# EAGLE design CT Sensor with Photon (EAGLE 9.5.1)
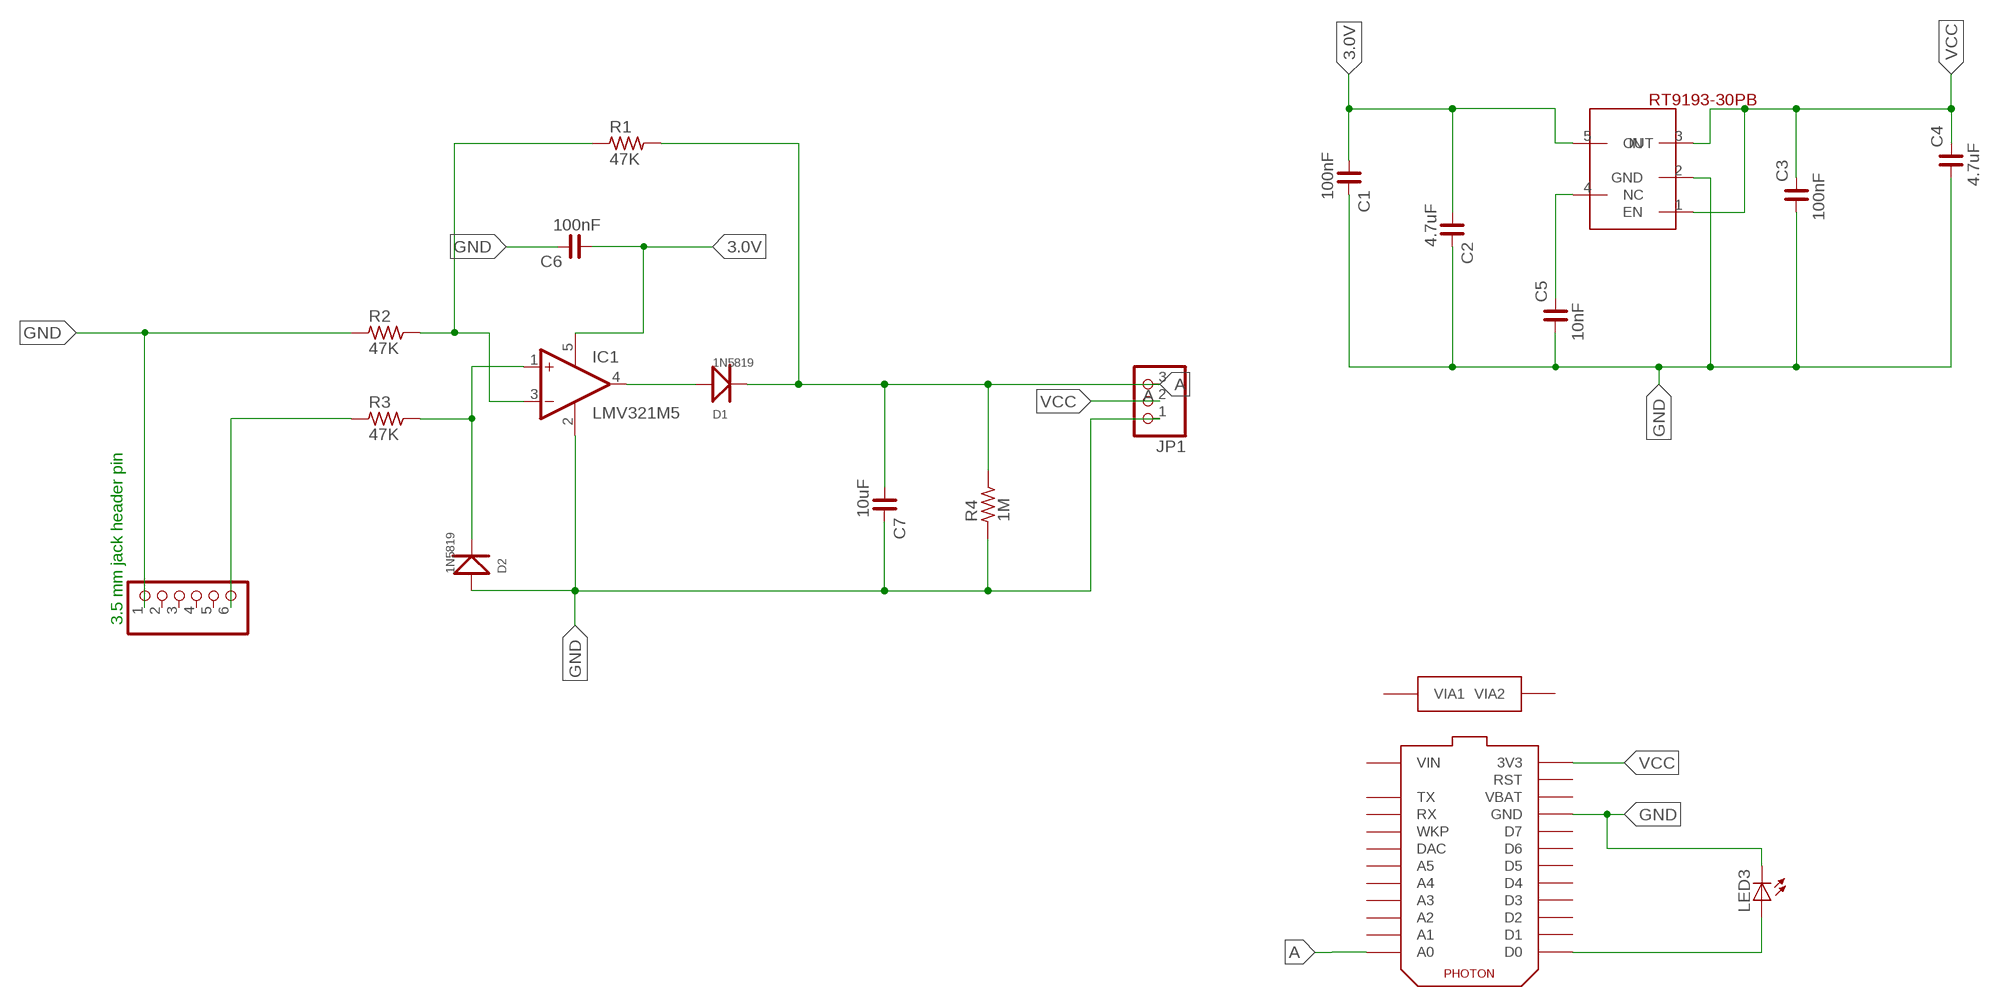
[diagram p0: schematic, sheet 1]

## Parts
C1  100nF  C_0201  [C0201]
C2  4.7uF  C_0201  [C0201]
C3  100nF  C_0201  [C0201]
C4  4.7uF  C_0201  [C0201]
C5  10nF  C_0201  [C0201]
C6  100nF  C_0201  [C0201]
C7  10uF  C_0201  [C0201]
D1  1N5819  [SOD-123]
D2  1N5819  [SOD-123]
IC1  LMV321M5  [SOT23-5]
JP1  PINHD-1X3  [1X03]
JP2  PINHD-1X6  [1X06]
LED3  LED  [SMARTLED-TTW]
R1  47K  R_0201  [R0201]
R2  47K  R_0201  [R0201]
R3  47K  R_0201  [R0201]
R4  1M  R_0201  [R0201]
U$1  RT9193-30PB  [SOP65P212X110-6N]
U$2  TEMPLATE_PHOTON_RAW  [PHOTON_RAW]

## Nets
3.0V: C1.1 C2.1 C6.1 IC1.5(V+) U$1.5(OUT)
A: C7.1 D1.K JP1.3 R1.2 R4.2 U$2.A0 U$2.A0.(A0) U$2.A0@1(A0)
GND: C1.2 C2.2 C3.1 C4.1 C5.1 C6.2 C7.2 D2.A IC1.2(V-) JP1.1 JP2.1 LED3.C@1(C) R2.1 R4.1 U$1.2(GND) U$2.GND U$2.GND1(GND) U$2.GND.(GND) U$2.GND.@1(GND) U$2.GND@1(GND) U$2.GND@2(GND)
N$1: D2.K IC1.1(+IN) R3.2
N$2: C5.2 U$1.4(NC)
N$3: IC1.3(-IN) R1.1 R2.2
N$4: D1.A IC1.4(OUT)
N$5: LED3.A@1(A) U$2.D0 U$2.D0.(D0) U$2.D0@1(D0)
N$6: JP2.6 R3.1
VCC: C3.2 C4.2 JP1.2 U$1.1(EN) U$1.3(IN) U$2.3V3 U$2.3V3.(3V3) U$2.3V31(3V3)
Unconnected: JP2.2 JP2.3 JP2.4 JP2.5 U$2.A1 U$2.A1.(A1) U$2.A1@1(A1) U$2.A2 U$2.A2.(A2) U$2.A2@1(A2) U$2.A3 U$2.A3.(A3) U$2.A3@1(A3) U$2.A4 U$2.A4.(A4) U$2.A4@1(A4) U$2.A5 U$2.A5.(A5) U$2.A5@1(A5) U$2.D1 U$2.D1.(D1) U$2.D1@1(D1) U$2.D2 U$2.D2.(D2) U$2.D2@1(D2) U$2.D3 U$2.D3.(D3) U$2.D3@1(D3) U$2.D4 U$2.D4.(D4) U$2.D4@1(D4) U$2.D5 U$2.D5.(D5) U$2.D5@1(D5) U$2.D6 U$2.D6.(D6) U$2.D6@1(D6) U$2.D7 U$2.D7.(D7) U$2.D7@1(D7) U$2.DAC U$2.DAC1(DAC) U$2.DAC.(DAC) U$2.P$1(VIA1) U$2.P$2(VIA2) U$2.RST U$2.RST1(RST) U$2.RST.(RST) U$2.RX U$2.RX1(RX) U$2.RX.(RX) U$2.TX U$2.TX1(TX) U$2.TX.(TX) U$2.VBAT U$2.VBAT1(VBAT) U$2.VBAT.(VBAT) U$2.VIN U$2.VIN1(VIN) U$2.VIN.(VIN) U$2.WKP U$2.WKP1(WKP) U$2.WKP.(WKP)

## Notes on the sheet
- 3.5 mm jack header pin

## Library data of the parts
C1-C7 = rc-master-smd:C_: NON-POLARIZED CAP
D1 D2 = 1N5819:1N5819: Buy Part <https://snapeda.com/parts/1N5819/STMicroelectronics/view-part/?ref=eda>; ARROW_ELECTRONICS-PURCHASE-URL: https://snapeda.com/shop?store=Arrow+Electronics&id=2598553; AVAILABILITY: Good; DESCRIPTION: Diode Schottky 40V 1A Through Hole DO-41; DIGIKEY-PURCHASE-URL: https://snapeda.com/shop?store=DigiKey&id=2598553; MF: STMicroelectronics; MOUSER-PURCHASE-URL: https://snapeda.com/shop?store=Mouser&id=2598553; MP: 1N5819; PACKAGE: DO-41 STMicroelectronics; PRICE: None
IC1 = LMV321__:LMV321?*: General Purpose, Low Voltage, Rail-to-Rail Output Operational Amplifiers Source: http://www.national.com/mpf/LM/LMV321.html http://www.national.com/dt/lmv_qual.pdf; AVAILABILITY: Unavailable; DESCRIPTION: General Purpose Amplifier 1 Circuit Rail-to-Rail SOT-23-5; MF: STMicroelectronics; MP: LMV321; PACKAGE: SOT-23-5 STMicroelectronics; PRICE: None
JP1 = adafruit:PINHD-1X3: PIN HEADER
JP2 = adafruit:PINHD-1X6: PIN HEADER
LED3 = adafruit:LED: LED OSRAM: - CHIPLED LG R971, LG N971, LY N971, LG Q971, LY Q971, LO R971, LY R971 LH N974, LH R974 LS Q976, LO Q976, LY Q976 LO Q996 - Hyper CHIPLED LW Q18S LB Q993, LB Q99A, LB R99A - SideLED LS A670, LO A670, LY A670, LG A670, LP A670 LB A673, LV A673, LT A673, LW A673 LH A674 LY A675 LS A676, LA A676, LO A676, LY A676, LW A676 LS A679, LY A679, LG A679 - Hyper Micro SIDELED® LS Y876, LA Y876, LO Y876, LY Y876 LT Y87S - SmartLED LW L88C, LW L88S LB L89C, LB L89S, LG L890 LS L89K, LO L89K, LY L89K LS L896, LA L896, LO L896, LY L896 - TOPLED LS T670, LO T670, LY T670, LG T670, LP T670 LSG T670, LSP T670, LSY T670, LOP T670, LYG T670 LG T671, LOG T671, LSG T671 LB T673, LV T673, LT T673, LW T673 LH T674 LS T676, LA T676, LO T676, LY T676, LB T676, LH T676, LSB T676, LW T676 LB T67C, LV T67C, LT T67C, LS T67K, LO T67K, LY T67K, LW E67C LS E67B, LA E67B, LO E67B, LY E67B, LB E67C, LV E67C, LT E67C LW T67C LS T679, LY T679, LG T679 LS T770, LO T770, LY T770, LG T770, LP T770 LB T773, LV T773, LT T773, LW T773 LH T774 LS E675, LA E675, LY E675, LS T675 LS T776, LA T776, LO T776, LY T776, LB T776 LHGB T686 LT T68C, LB T68C - Hyper Mini TOPLED® LB M676 - Mini TOPLED Santana® LG M470 LS M47K, LO M47K, LY M47K Source: http://www.osram.convergy.de/
R1-R4 = rc-master-smd:R_: RESISTOR
U$1 = RT9193-30PB:RT9193-30PB
U$2 = voltera_community_lib:TEMPLATE_PHOTON

## Board
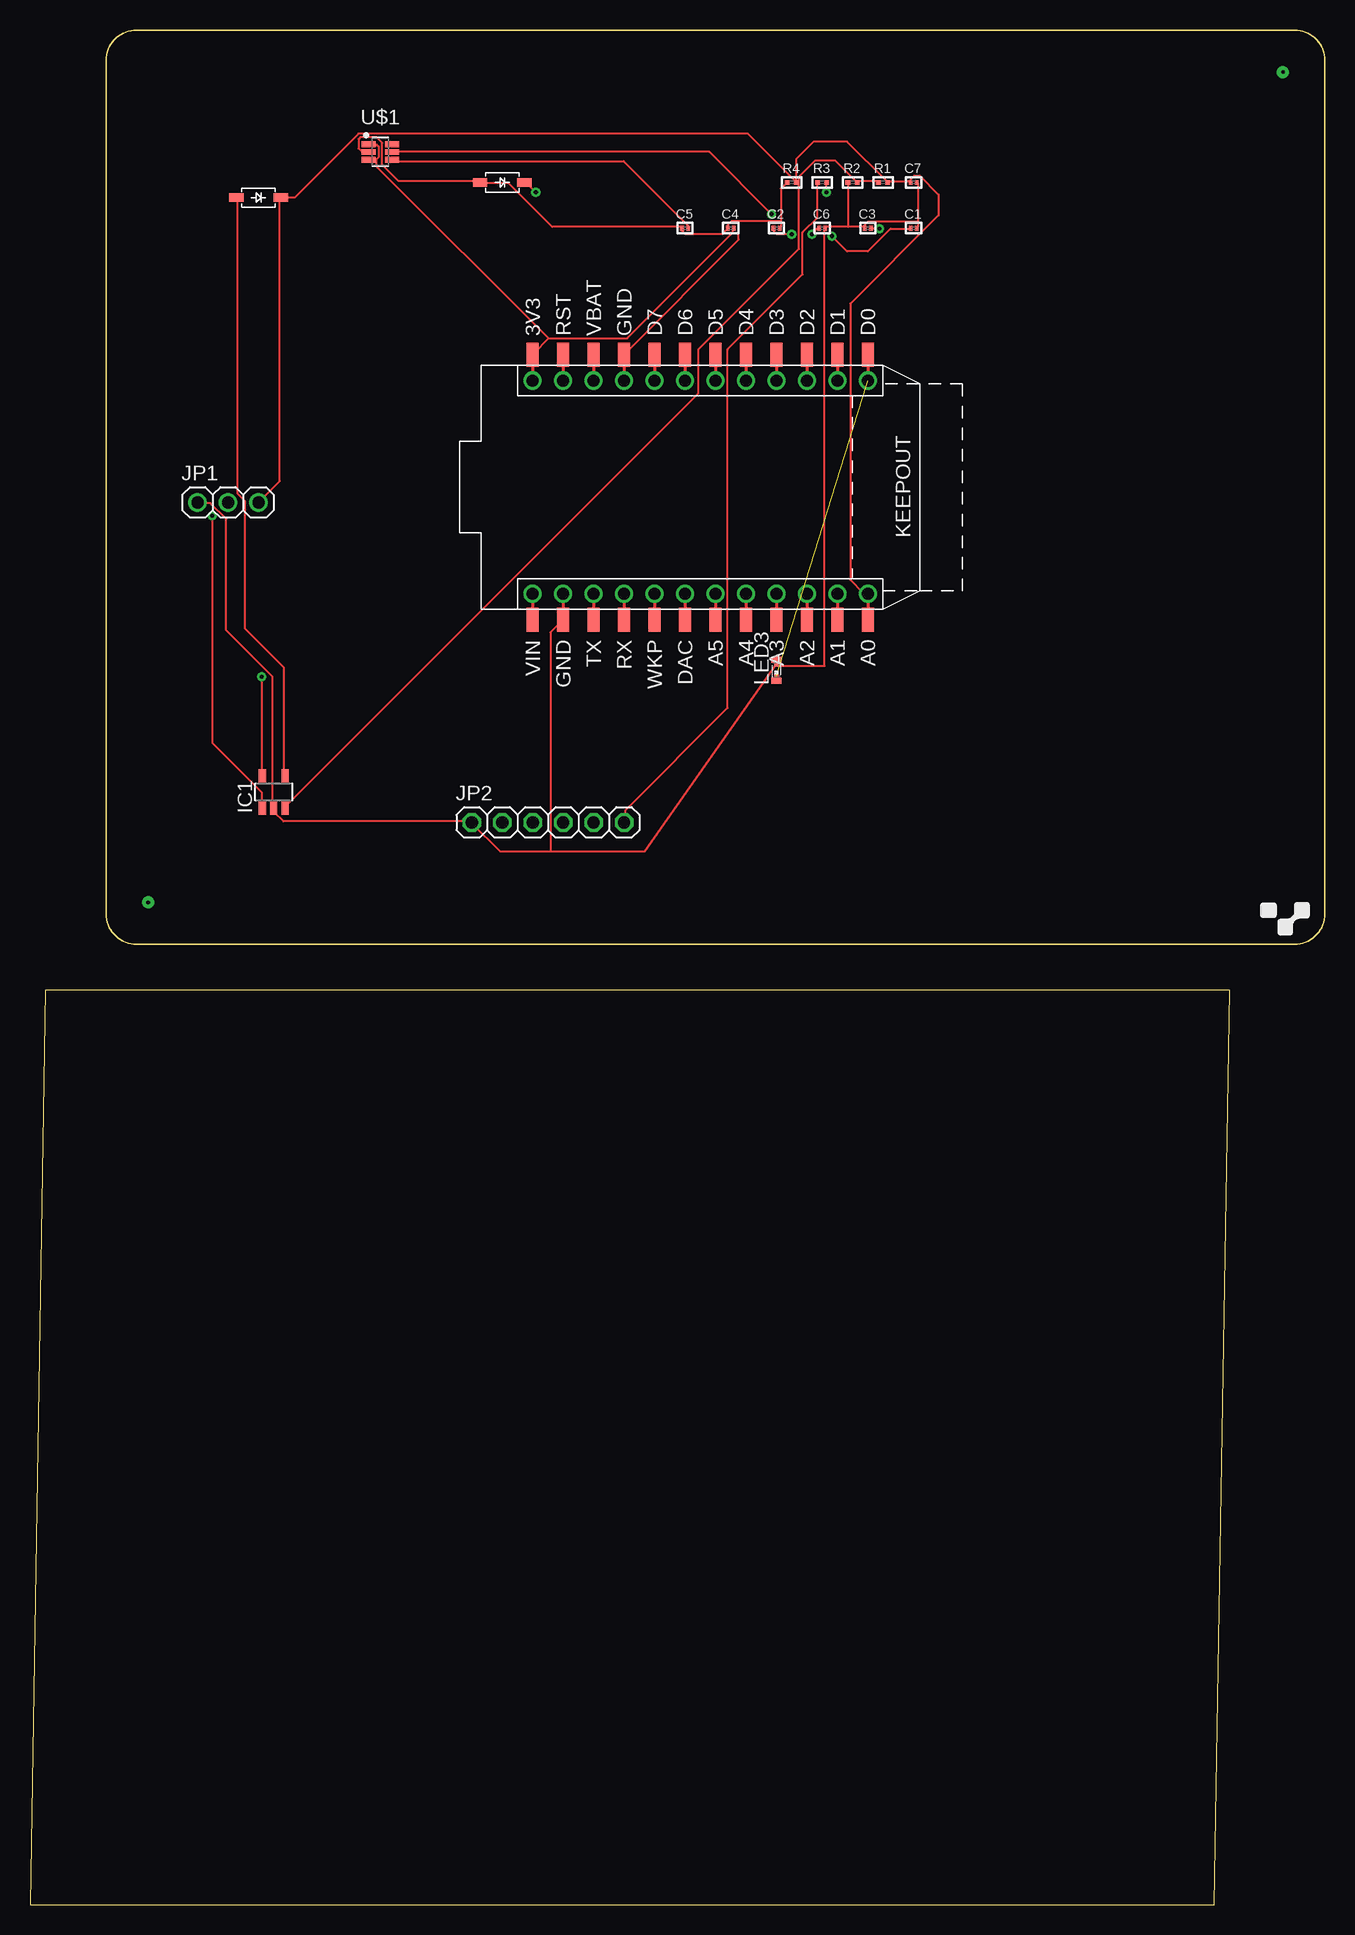
[diagram p1: board, top side]
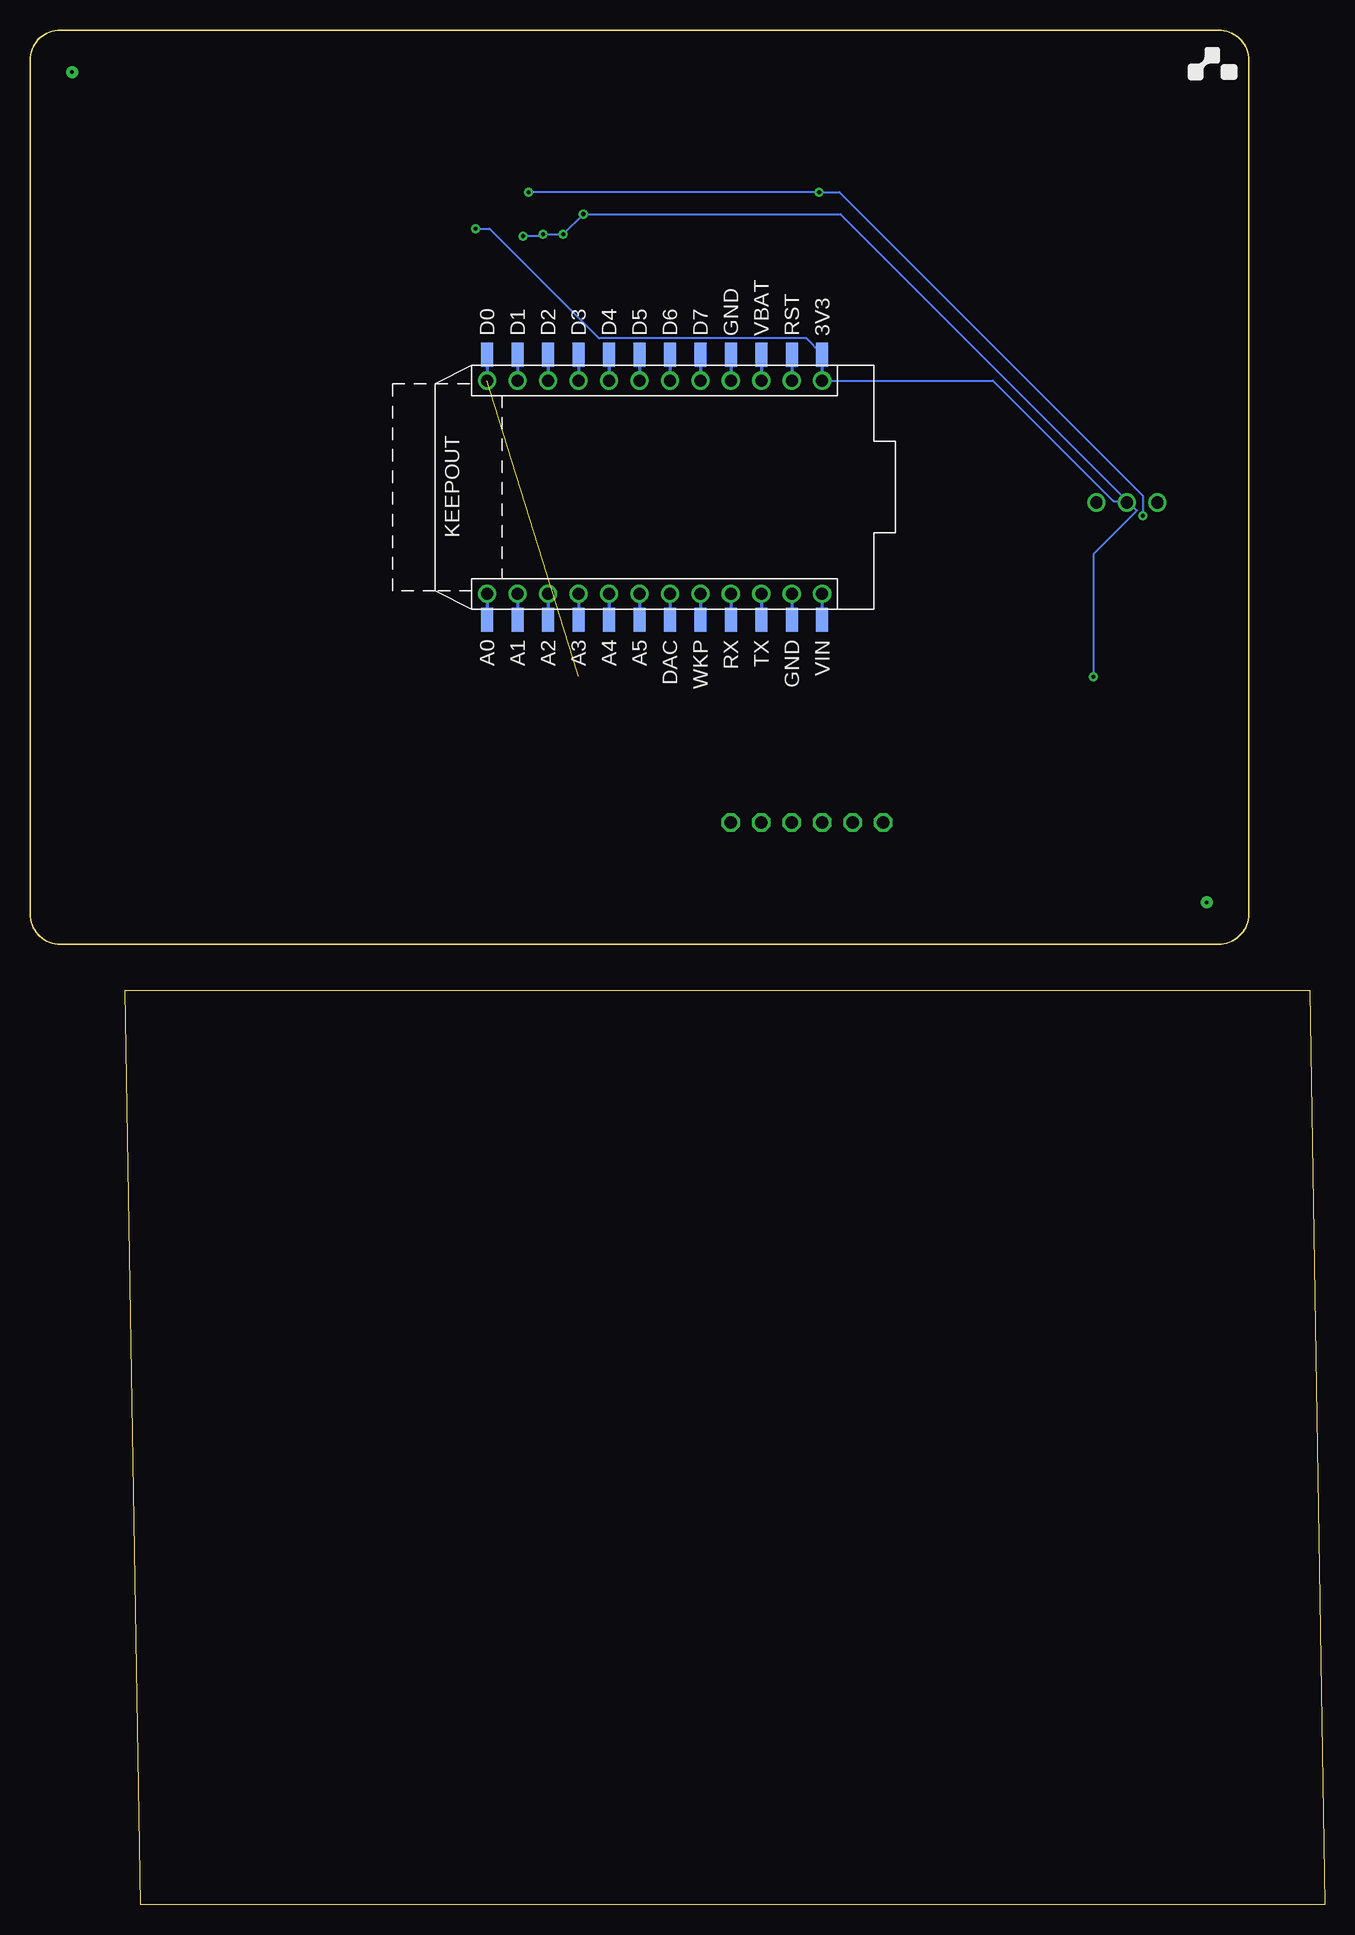
[diagram p2: board, bottom side, seen from below]

Size 107.95 x 156.21 mm. Coordinates in mm from the lower left corner, seen from the top.
Outline: 0,0 98.73,0 100,76.19 1.27,76.19 0,0
Copper layers (1*16): Top 0.035mm / dielectric 1.5mm / Bottom 0.035mm
Design rules "default": minimum track width 6mil, minimum drill 0.35mm, track to track 6mil, track to pad 6mil, pad to pad 6mil, via to via 6mil, smd to smd 6mil, copper to edge 40mil, drill to drill 6mil, minimum pad ring 10mil, minimum via ring 8mil, stop-mask expansion 4mil, vias tented up to drill 0mil, thermal gap 10mil

### Footprints (pad centres in the part's own frame; a part is rotated, then mirrored left to right if it is on the bottom)
C0201 = smd 0.3 x 0.4: 1 -0.254,0; 2 0.254,0
SOD-123 = smd 1.2 x 0.7: A -1.85,0; K 1.85,0
SOT23-5 = smd 0.6 x 1.2: 1 -0.95,-1.306; 2 0,-1.306; 3 0.95,-1.306; 4 0.95,1.306; 5 -0.95,1.306
1X03 = drill 1.016: 1 -2.54,0; 2 0,0; 3 2.54,0
1X06 = drill 1.016 octagon: 1 -6.35,0; 2 -3.81,0; 3 -1.27,0; 4 1.27,0; 5 3.81,0; 6 6.35,0
SMARTLED-TTW = smd 0.8 x 0.5: A 0,-0.875; C 0,0.875 | smd 0.35 x 0.35: A@1 0,-0.5; C@1 0,0.5
R0201 = smd 0.4 x 0.4: 1 -0.381,0; 2 0.381,0
SOP65P212X110-6N = smd 1.192 x 0.484: 1 -0.984,0.65; 2 -0.984,0; 3 -0.984,-0.65; 4 0.984,-0.65; 5 0.984,0; 6 0.984,0.65
PHOTON_RAW = smd 1 x 2 bottom: 3V3 35.56,49.13; A0 63.5,27.07; A1 60.96,27.07; A2 58.42,27.07; A3 55.88,27.07; A4 53.34,27.07; A5 50.8,27.07; D0 63.5,49.13; D1 60.96,49.13; D2 58.42,49.13; D3 55.88,49.13; D4 53.34,49.13; D5 50.8,49.13; D6 48.26,49.13; D7 45.72,49.13; DAC 48.26,27.07; GND 38.1,27.07; GND@1 43.18,49.13; RST 38.1,49.13; RX 43.18,27.07; TX 40.64,27.07; VBAT 40.64,49.13; VIN 35.56,27.07; WKP 45.72,27.07 | drill 1: 3V3. 35.56,46.99; A0. 63.5,29.21; A1. 60.96,29.21; A2. 58.42,29.21; A3. 55.88,29.21; A4. 53.34,29.21; A5. 50.8,29.21; D0. 63.5,46.99; D1. 60.96,46.99; D2. 58.42,46.99; D3. 55.88,46.99; D4. 53.34,46.99; D5. 50.8,46.99; D6. 48.26,46.99; D7. 45.72,46.99; DAC. 48.26,29.21; GND. 38.1,29.21; GND.@1 43.18,46.99; RST. 38.1,46.99; RX. 43.18,29.21; TX. 40.64,29.21; VBAT. 40.64,46.99; VIN. 35.56,29.21; WKP. 45.72,29.21 | smd 1 x 2: 3V31 35.56,49.13; A0@1 63.5,27.07; A1@1 60.96,27.07; A2@1 58.42,27.07; A3@1 55.88,27.07; A4@1 53.34,27.07; A5@1 50.8,27.07; D0@1 63.5,49.13; D1@1 60.96,49.13; D2@1 58.42,49.13; D3@1 55.88,49.13; D4@1 53.34,49.13; D5@1 50.8,49.13; D6@1 48.26,49.13; D7@1 45.72,49.13; DAC1 48.26,27.07; GND1 38.1,27.07; GND@2 43.18,49.13; RST1 38.1,49.13; RX1 43.18,27.07; TX1 40.64,27.07; VBAT1 40.64,49.13; VIN1 35.56,27.07; WKP1 45.72,27.07 | drill 0.3 pad 1: P$1 3.5,3.5; P$2 98.1,72.7

### Placement (x,y rotation side)
C1  73.66,139.7 0 top
C2  62.23,139.7 0 top
C3  69.85,139.7 0 top
C4  58.42,139.7 0 top
C5  54.61,139.7 0 top
C6  66.04,139.7 0 top
C7  73.66,143.51 0 top
D1  19.05,142.24 0 top
D2  39.37,143.51 0 top
IC1  20.32,92.71 0 top
JP1  16.51,116.84 0 top
JP2  43.18,90.17 0 top
LED3  62.23,102.87 0 top
R1  71.12,143.51 0 top
R2  68.58,143.51 0 top
R3  66.04,143.51 0 top
R4  63.5,143.51 0 top
U$1  29.21,146.05 0 top
U$2  6.35,80.01 0 top

### Tracks (layer width: path | path; a pad name or v marks a point on that pad's centre or on a via)
3.0V  (via drill 0.35)
  Top 0.152: C2.1 61.98,139.5 62.28,139.19 v63.5,139.19 | v65.18,139.19 65.79,139.8 C6.1 | v66.85,139.04 68.12,137.77 69.85,137.77 71.73,139.65 73.41,139.65 C1.1 | U$1.5 56.64,146.05 v61.82,140.87 | IC1.5 19.3,94.08 v19.3,102.31 19.55,102.55
  Bottom 0.152: v66.85,139.04 65.33,139.04 v65.18,139.19 v63.5,139.19 v61.82,140.87 40.39,140.87 15.67,116.15 19.3,112.52 v19.3,102.31
A
  Top 0.152: JP1.3 20.83,118.62 20.83,142.24 D1.K 22.05,142.24 27.38,147.57 59.84,147.57 63.8,143.61 R4.2 63.88,145.47 65.33,146.91 68.12,146.91 71.42,143.61 R1.2 71.58,143.61 73.25,143.61 | 73.25,143.61 73.41,143.61 C7.1 | 73.25,143.61 73.71,144.07 74.17,144.07 75.74,142.49 75.74,140.77 68.38,133.4 68.38,110.39 69.44,109.32 69.75,109.32 U$2.A0.
GND
  Top 0.152: U$1.2 27.69,146.05 27.38,146.36 27.38,147.12 27.53,147.27 28.91,147.27 29.36,146.81 29.36,144.98 30.73,143.61 37.44,143.61 D2.A 37.59,143.46 39.88,143.46 43.54,139.8 54.36,139.8 C5.1 54.36,139.5 54.66,139.19 57.71,139.19 58.17,139.65 C4.1 58.17,139.95 58.47,140.26 59.08,140.26 | 62.59,140.26 62.59,143 63.04,143.46 R4.1 | 62.59,140.26 62.59,139.8 C2.2 | 62.59,140.26 59.08,140.26 | 59.08,140.26 59.08,138.74 49.63,129.29 U$2.GND@1 | 74.02,140.26 74.02,143.46 C7.2 | 74.02,140.26 74.02,139.8 C1.2 | 69.44,139.8 69.6,139.8 C3.1 | 69.44,139.8 68.22,139.8 | 68.22,139.8 66.4,139.8 C6.2 66.24,139.65 66.24,103.23 62.28,103.23 LED3.C@1 51.26,87.78 43.38,87.78 | 68.22,139.8 68.22,143.46 R2.1 | 74.02,140.26 69.9,140.26 69.44,139.8 | 43.38,87.78 39.17,87.78 36.83,90.12 JP2.1 36.83,90.27 21.13,90.27 20.37,91.03 20.37,91.34 IC1.2 20.22,91.49 20.22,102.31 16.36,106.17 16.36,115.47 15.04,116.79 13.97,116.79 JP1.1 | U$2.GND 43.38,106.01 43.38,87.78
N$1  (via drill 0.35)
  Top 0.152: v66.4,142.7 66.4,143.46 R3.2 | v42.16,142.7 41.25,143.61 D2.K | v15.19,115.72 15.19,96.83 19.3,92.71 19.3,91.49 IC1.1
  Bottom 0.152: v66.4,142.7 v42.16,142.7 40.49,142.7 15.19,117.4 v15.19,115.72
N$2
  Top 0.152: C5.2 54.81,139.8 54.81,139.95 49.48,145.29 30.28,145.29 U$1.4
N$3
  Top 0.152: R1.1 70.66,143.61 68.99,143.61 R2.2 68.83,143.61 67.11,145.34 65.48,145.34 64.11,143.97 64.11,137.97 55.73,129.59 55.73,125.93 21.29,91.49 IC1.3
N$4
  Top 0.152: IC1.4 21.13,94.15 21.13,103.12 17.93,106.32 17.93,116.94 17.32,117.55 17.32,142.24 D1.A
N$5  (1 unrouted)
N$6
  Top 0.152: R3.1 65.63,143.46 65.63,140.56 64.41,139.34 64.41,135.84 58.17,129.59 58.17,99.72 49.63,91.19 49.63,90.27 JP2.6
VCC  (via drill 0.35)
  Top 0.152: 28.91,145.44 28.3,145.44 U$1.3 | 28.91,145.44 29.06,145.59 29.06,146.51 28.91,146.66 28.3,146.66 U$1.1 | 43.23,130.5 49.78,130.5 58.62,139.34 58.62,139.65 C4.2 | 43.23,130.5 42.01,129.29 U$2.3V3 | v70.81,139.65 70.21,139.65 C3.2 | 28.91,145.44 28.91,144.83 43.23,130.5
  Bottom 0.152: v70.81,139.65 69.65,139.65 60.5,130.5 43.23,130.5 42.01,129.29 U$2.3V3 | U$2.3V3. 27.69,127 17.63,116.94 16.56,116.94 JP1.2